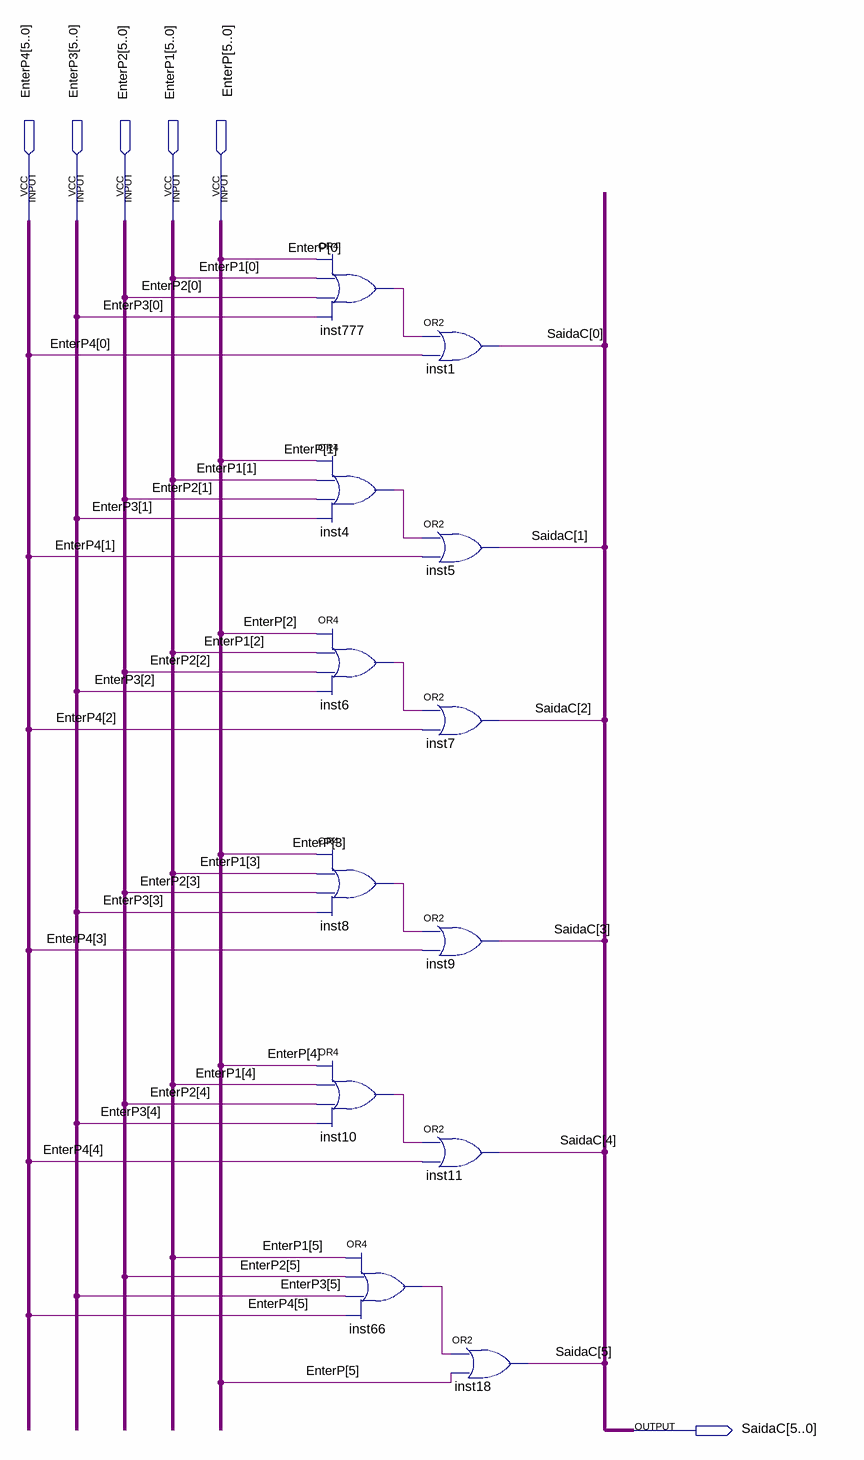
[diagram p0: schematic sheet]
// Quartus schematic MuxSoma.bdf as structural Verilog: 12 symbols, 6 pins
module MuxSoma (
  input  [5:0] EnterP4,
  input  [5:0] EnterP3,
  input  [5:0] EnterP2,
  input  [5:0] EnterP1,
  input  [5:0] EnterP,
  output [5:0] SaidaC
);

  wire inst4_out, inst6_out, inst8_out, inst10_out, inst66_out, inst777_out;

  or inst777 (inst777_out, EnterP[0], EnterP1[0], EnterP2[0], EnterP3[0]);
  or inst4 (inst4_out, EnterP[1], EnterP1[1], EnterP2[1], EnterP3[1]);
  or inst6 (inst6_out, EnterP[2], EnterP1[2], EnterP2[2], EnterP3[2]);
  or inst8 (inst8_out, EnterP[3], EnterP1[3], EnterP2[3], EnterP3[3]);
  or inst10 (inst10_out, EnterP[4], EnterP1[4], EnterP2[4], EnterP3[4]);
  or inst66 (inst66_out, EnterP1[5], EnterP2[5], EnterP3[5], EnterP4[5]);
  or inst1 (SaidaC[0], inst777_out, EnterP4[0]);
  or inst5 (SaidaC[1], inst4_out, EnterP4[1]);
  or inst7 (SaidaC[2], inst6_out, EnterP4[2]);
  or inst9 (SaidaC[3], inst8_out, EnterP4[3]);
  or inst11 (SaidaC[4], inst10_out, EnterP4[4]);
  or inst18 (SaidaC[5], inst66_out, EnterP[5]);
endmodule
